# EAGLE design Switching and Pico (EAGLE 9.6.2)
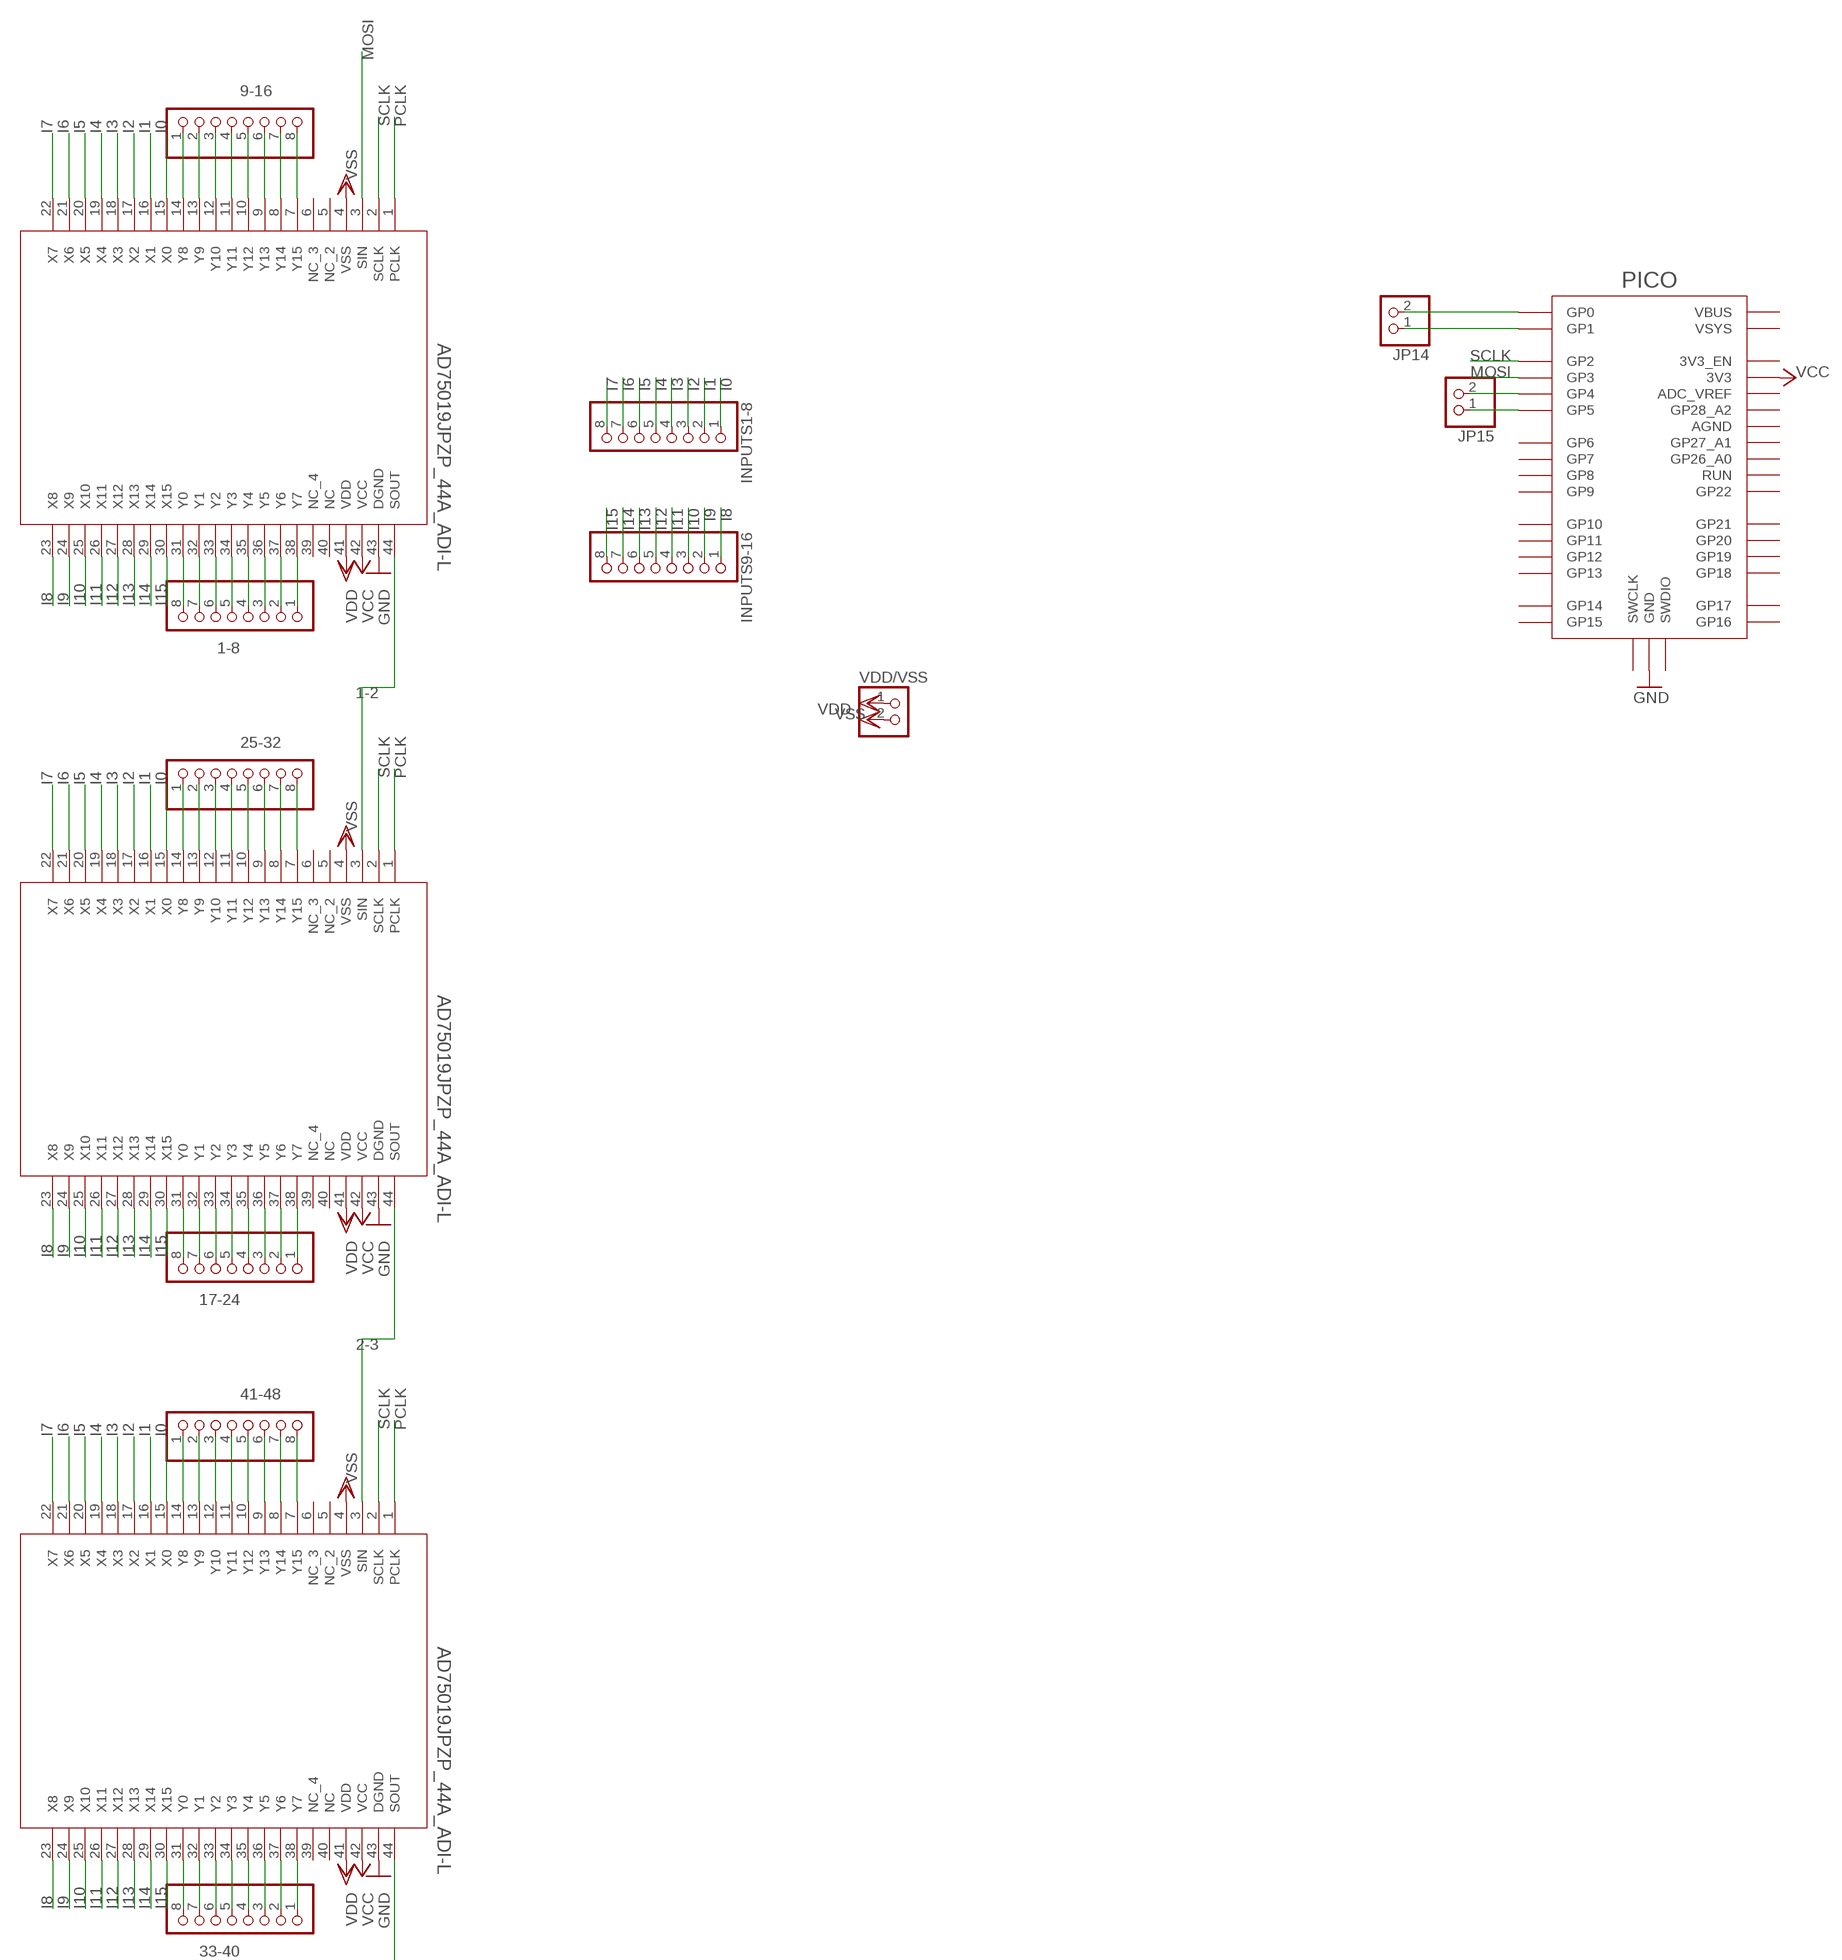
[diagram p0: schematic, sheet 1, part 1 of 2]
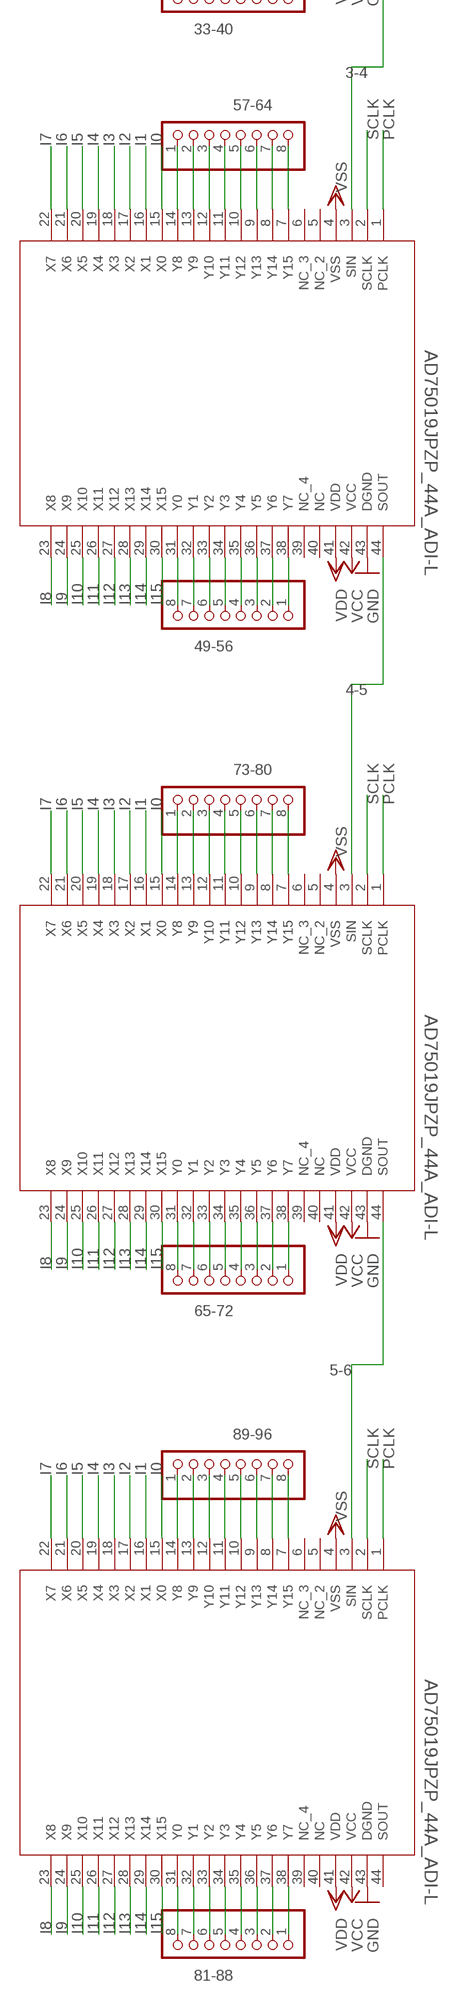
[diagram p1: schematic, sheet 1, part 2 of 2]

## Parts
1-8  PINHD-1X8  [1X08]
9-16  PINHD-1X8  [1X08]
17-24  PINHD-1X8  [1X08]
25-32  PINHD-1X8  [1X08]
33-40  PINHD-1X8  [1X08]
41-48  PINHD-1X8  [1X08]
49-56  PINHD-1X8  [1X08]
57-64  PINHD-1X8  [1X08]
65-72  PINHD-1X8  [1X08]
73-80  PINHD-1X8  [1X08]
81-88  PINHD-1X8  [1X08]
89-96  PINHD-1X8  [1X08]
INPUTS1-8  PINHD-1X8  [1X08]
INPUTS9-16  PINHD-1X8  [1X08]
JP14  PINHD-1X2  [1X02]
JP15  PINHD-1X2  [1X02]
PICO  RPI_PICO-TH  [RPI_PICO_TH]
SWITCH1  AD75019JPZP_44A_ADI-L  [P_44A_ADI-L]
SWITCH2  AD75019JPZP_44A_ADI-L  [P_44A_ADI-L]
SWITCH3  AD75019JPZP_44A_ADI-L  [P_44A_ADI-L]
SWITCH4  AD75019JPZP_44A_ADI-L  [P_44A_ADI-L]
SWITCH5  AD75019JPZP_44A_ADI-L  [P_44A_ADI-L]
SWITCH6  AD75019JPZP_44A_ADI-L  [P_44A_ADI-L]
VDD/VSS  PINHD-1X2  [1X02]

## Nets
1-2: SWITCH1.44(SOUT) SWITCH2.3(SIN)
2-3: SWITCH2.44(SOUT) SWITCH3.3(SIN)
3-4: SWITCH3.44(SOUT) SWITCH4.3(SIN)
4-5: SWITCH4.44(SOUT) SWITCH5.3(SIN)
5-6: SWITCH5.44(SOUT) SWITCH6.3(SIN)
GND: PICO.GND@1(GND) PICO.GND@2(GND) PICO.GND@3(GND) PICO.GND@4(GND) PICO.GND@5(GND) PICO.GND@6(GND) PICO.GND@7(GND) PICO.GND@8(GND) SWITCH1.43(DGND) SWITCH2.43(DGND) SWITCH3.43(DGND) SWITCH4.43(DGND) SWITCH5.43(DGND) SWITCH6.43(DGND)
I0: INPUTS1-8.1 SWITCH1.15(X0) SWITCH2.15(X0) SWITCH3.15(X0) SWITCH4.15(X0) SWITCH5.15(X0) SWITCH6.15(X0)
I1: INPUTS1-8.2 SWITCH1.16(X1) SWITCH2.16(X1) SWITCH3.16(X1) SWITCH4.16(X1) SWITCH5.16(X1) SWITCH6.16(X1)
I2: INPUTS1-8.3 SWITCH1.17(X2) SWITCH2.17(X2) SWITCH3.17(X2) SWITCH4.17(X2) SWITCH5.17(X2) SWITCH6.17(X2)
I3: INPUTS1-8.4 SWITCH1.18(X3) SWITCH2.18(X3) SWITCH3.18(X3) SWITCH4.18(X3) SWITCH5.18(X3) SWITCH6.18(X3)
I4: INPUTS1-8.5 SWITCH1.19(X4) SWITCH2.19(X4) SWITCH3.19(X4) SWITCH4.19(X4) SWITCH5.19(X4) SWITCH6.19(X4)
I5: INPUTS1-8.6 SWITCH1.20(X5) SWITCH2.20(X5) SWITCH3.20(X5) SWITCH4.20(X5) SWITCH5.20(X5) SWITCH6.20(X5)
I6: INPUTS1-8.7 SWITCH1.21(X6) SWITCH2.21(X6) SWITCH3.21(X6) SWITCH4.21(X6) SWITCH5.21(X6) SWITCH6.21(X6)
I7: INPUTS1-8.8 SWITCH1.22(X7) SWITCH2.22(X7) SWITCH3.22(X7) SWITCH4.22(X7) SWITCH5.22(X7) SWITCH6.22(X7)
I8: INPUTS9-16.1 SWITCH1.23(X8) SWITCH2.23(X8) SWITCH3.23(X8) SWITCH4.23(X8) SWITCH5.23(X8) SWITCH6.23(X8)
I9: INPUTS9-16.2 SWITCH1.24(X9) SWITCH2.24(X9) SWITCH3.24(X9) SWITCH4.24(X9) SWITCH5.24(X9) SWITCH6.24(X9)
I10: INPUTS9-16.3 SWITCH1.25(X10) SWITCH2.25(X10) SWITCH3.25(X10) SWITCH4.25(X10) SWITCH5.25(X10) SWITCH6.25(X10)
I11: INPUTS9-16.4 SWITCH1.26(X11) SWITCH2.26(X11) SWITCH3.26(X11) SWITCH4.26(X11) SWITCH5.26(X11) SWITCH6.26(X11)
I12: INPUTS9-16.5 SWITCH1.27(X12) SWITCH2.27(X12) SWITCH3.27(X12) SWITCH4.27(X12) SWITCH5.27(X12) SWITCH6.27(X12)
I13: INPUTS9-16.6 SWITCH1.28(X13) SWITCH2.28(X13) SWITCH3.28(X13) SWITCH4.28(X13) SWITCH5.28(X13) SWITCH6.28(X13)
I14: INPUTS9-16.7 SWITCH1.29(X14) SWITCH2.29(X14) SWITCH3.29(X14) SWITCH4.29(X14) SWITCH5.29(X14) SWITCH6.29(X14)
I15: INPUTS9-16.8 SWITCH1.30(X15) SWITCH2.30(X15) SWITCH3.30(X15) SWITCH4.30(X15) SWITCH5.30(X15) SWITCH6.30(X15)
MOSI: PICO.GP3 SWITCH1.3(SIN)
N$2: 17-24.8 SWITCH2.31(Y0)
N$3: 17-24.7 SWITCH2.32(Y1)
N$4: 17-24.6 SWITCH2.33(Y2)
N$6: 17-24.5 SWITCH2.34(Y3)
N$7: 17-24.4 SWITCH2.35(Y4)
N$8: 17-24.3 SWITCH2.36(Y5)
N$9: 17-24.2 SWITCH2.37(Y6)
N$10: 17-24.1 SWITCH2.38(Y7)
N$11: 25-32.1 SWITCH2.14(Y8)
N$12: 25-32.2 SWITCH2.13(Y9)
N$13: 25-32.3 SWITCH2.12(Y10)
N$14: 25-32.4 SWITCH2.11(Y11)
N$15: 25-32.5 SWITCH2.10(Y12)
N$16: 25-32.6 SWITCH2.9(Y13)
N$17: 25-32.7 SWITCH2.8(Y14)
N$18: 1-8.8 SWITCH1.31(Y0)
N$19: 1-8.7 SWITCH1.32(Y1)
N$20: 1-8.6 SWITCH1.33(Y2)
N$21: 1-8.5 SWITCH1.34(Y3)
N$22: 1-8.4 SWITCH1.35(Y4)
N$23: 1-8.3 SWITCH1.36(Y5)
N$24: 1-8.2 SWITCH1.37(Y6)
N$25: 1-8.1 SWITCH1.38(Y7)
N$26: 9-16.1 SWITCH1.14(Y8)
N$27: 9-16.2 SWITCH1.13(Y9)
N$28: 9-16.3 SWITCH1.12(Y10)
N$29: 9-16.4 SWITCH1.11(Y11)
N$30: 9-16.5 SWITCH1.10(Y12)
N$31: 9-16.6 SWITCH1.9(Y13)
N$32: 9-16.7 SWITCH1.8(Y14)
N$33: 9-16.8 SWITCH1.7(Y15)
N$34: 25-32.8 SWITCH2.7(Y15)
N$36: 33-40.8 SWITCH3.31(Y0)
N$37: 33-40.7 SWITCH3.32(Y1)
N$38: 33-40.6 SWITCH3.33(Y2)
N$39: 33-40.5 SWITCH3.34(Y3)
N$40: 33-40.4 SWITCH3.35(Y4)
N$41: 33-40.3 SWITCH3.36(Y5)
N$42: 33-40.2 SWITCH3.37(Y6)
N$43: 33-40.1 SWITCH3.38(Y7)
N$44: 41-48.1 SWITCH3.14(Y8)
N$45: 41-48.2 SWITCH3.13(Y9)
N$46: 41-48.3 SWITCH3.12(Y10)
N$47: 41-48.4 SWITCH3.11(Y11)
N$48: 41-48.5 SWITCH3.10(Y12)
N$49: 41-48.6 SWITCH3.9(Y13)
N$50: 41-48.7 SWITCH3.8(Y14)
N$51: 41-48.8 SWITCH3.7(Y15)
N$53: 49-56.8 SWITCH4.31(Y0)
N$54: 49-56.7 SWITCH4.32(Y1)
N$55: 49-56.6 SWITCH4.33(Y2)
N$56: 49-56.5 SWITCH4.34(Y3)
N$57: 49-56.4 SWITCH4.35(Y4)
N$58: 49-56.3 SWITCH4.36(Y5)
N$59: 49-56.2 SWITCH4.37(Y6)
N$60: 49-56.1 SWITCH4.38(Y7)
N$61: 57-64.1 SWITCH4.14(Y8)
N$62: 57-64.2 SWITCH4.13(Y9)
N$63: 57-64.3 SWITCH4.12(Y10)
N$64: 57-64.4 SWITCH4.11(Y11)
N$65: 57-64.5 SWITCH4.10(Y12)
N$66: 57-64.6 SWITCH4.9(Y13)
N$67: 57-64.7 SWITCH4.8(Y14)
N$68: 57-64.8 SWITCH4.7(Y15)
N$70: 65-72.8 SWITCH5.31(Y0)
N$71: 65-72.7 SWITCH5.32(Y1)
N$72: 65-72.6 SWITCH5.33(Y2)
N$73: 65-72.5 SWITCH5.34(Y3)
N$74: 65-72.4 SWITCH5.35(Y4)
N$75: 65-72.3 SWITCH5.36(Y5)
N$76: 65-72.2 SWITCH5.37(Y6)
N$77: 65-72.1 SWITCH5.38(Y7)
N$78: 73-80.1 SWITCH5.14(Y8)
N$79: 73-80.2 SWITCH5.13(Y9)
N$80: 73-80.3 SWITCH5.12(Y10)
N$81: 73-80.4 SWITCH5.11(Y11)
N$82: 73-80.5 SWITCH5.10(Y12)
N$83: 73-80.6 SWITCH5.9(Y13)
N$84: 73-80.7 SWITCH5.8(Y14)
N$85: 73-80.8 SWITCH5.7(Y15)
N$86: JP14.2 PICO.GP0
N$87: 81-88.8 SWITCH6.31(Y0)
N$88: 81-88.7 SWITCH6.32(Y1)
N$89: 81-88.6 SWITCH6.33(Y2)
N$90: 81-88.5 SWITCH6.34(Y3)
N$91: 81-88.4 SWITCH6.35(Y4)
N$92: 81-88.3 SWITCH6.36(Y5)
N$93: 81-88.2 SWITCH6.37(Y6)
N$94: 81-88.1 SWITCH6.38(Y7)
N$95: 89-96.1 SWITCH6.14(Y8)
N$96: 89-96.2 SWITCH6.13(Y9)
N$97: 89-96.3 SWITCH6.12(Y10)
N$98: 89-96.4 SWITCH6.11(Y11)
N$99: 89-96.5 SWITCH6.10(Y12)
N$100: 89-96.6 SWITCH6.9(Y13)
N$101: 89-96.7 SWITCH6.8(Y14)
N$102: 89-96.8 SWITCH6.7(Y15)
N$103: JP14.1 PICO.GP1
N$104: JP15.2 PICO.GP4
N$105: JP15.1 PICO.GP5
PCLK: SWITCH1.1(PCLK) SWITCH2.1(PCLK) SWITCH3.1(PCLK) SWITCH4.1(PCLK) SWITCH5.1(PCLK) SWITCH6.1(PCLK)
SCLK: PICO.GP2 SWITCH1.2(SCLK) SWITCH2.2(SCLK) SWITCH3.2(SCLK) SWITCH4.2(SCLK) SWITCH5.2(SCLK) SWITCH6.2(SCLK)
VCC: PICO.3V3 SWITCH1.42(VCC) SWITCH2.42(VCC) SWITCH3.42(VCC) SWITCH4.42(VCC) SWITCH5.42(VCC) SWITCH6.42(VCC)
VDD: SWITCH1.41(VDD) SWITCH2.41(VDD) SWITCH3.41(VDD) SWITCH4.41(VDD) SWITCH5.41(VDD) SWITCH6.41(VDD) VDD/VSS.1
VSS: SWITCH1.4(VSS) SWITCH2.4(VSS) SWITCH3.4(VSS) SWITCH4.4(VSS) SWITCH5.4(VSS) SWITCH6.4(VSS) VDD/VSS.2
Unconnected: PICO.3V3_EN PICO.ADC_VREF PICO.AGND PICO.GP6 PICO.GP7 PICO.GP8 PICO.GP9 PICO.GP10 PICO.GP11 PICO.GP12 PICO.GP13 PICO.GP14 PICO.GP15 PICO.GP16 PICO.GP17 PICO.GP18 PICO.GP19 PICO.GP20 PICO.GP21 PICO.GP22 PICO.GP26_A0 PICO.GP27_A1 PICO.GP28_A2 PICO.RUN PICO.SWCLK PICO.SWDIO PICO.VBUS PICO.VSYS SWITCH1.5(NC_2) SWITCH1.6(NC_3) SWITCH1.39(NC_4) SWITCH1.40(NC) SWITCH2.5(NC_2) SWITCH2.6(NC_3) SWITCH2.39(NC_4) SWITCH2.40(NC) SWITCH3.5(NC_2) SWITCH3.6(NC_3) SWITCH3.39(NC_4) SWITCH3.40(NC) SWITCH4.5(NC_2) SWITCH4.6(NC_3) SWITCH4.39(NC_4) SWITCH4.40(NC) SWITCH5.5(NC_2) SWITCH5.6(NC_3) SWITCH5.39(NC_4) SWITCH5.40(NC) SWITCH6.5(NC_2) SWITCH6.6(NC_3) SWITCH6.39(NC_4) SWITCH6.40(NC) SWITCH6.44(SOUT)

## Library data of the parts
1-8 9-16 17-24 25-32 33-40 41-48 49-56 57-64 65-72 73-80 81-88 89-96 INPUTS1-8 INPUTS9-16 = pinhead:PINHD-1X8: PIN HEADER
JP14 JP15 VDD/VSS = pinhead:PINHD-1X2: PIN HEADER
PICO = RaspberryPi_Pico:RPI_PICO
SWITCH1-SWITCH6 = AD75019JPZ:AD75019JPZ; COPYRIGHT: Copyright (C) 2024 Ultra Librarian. All rights reserved.; MANUFACTURER_PART_NUMBER: AD75019JPZ; MFR_NAME: Analog Devices Inc

## Board
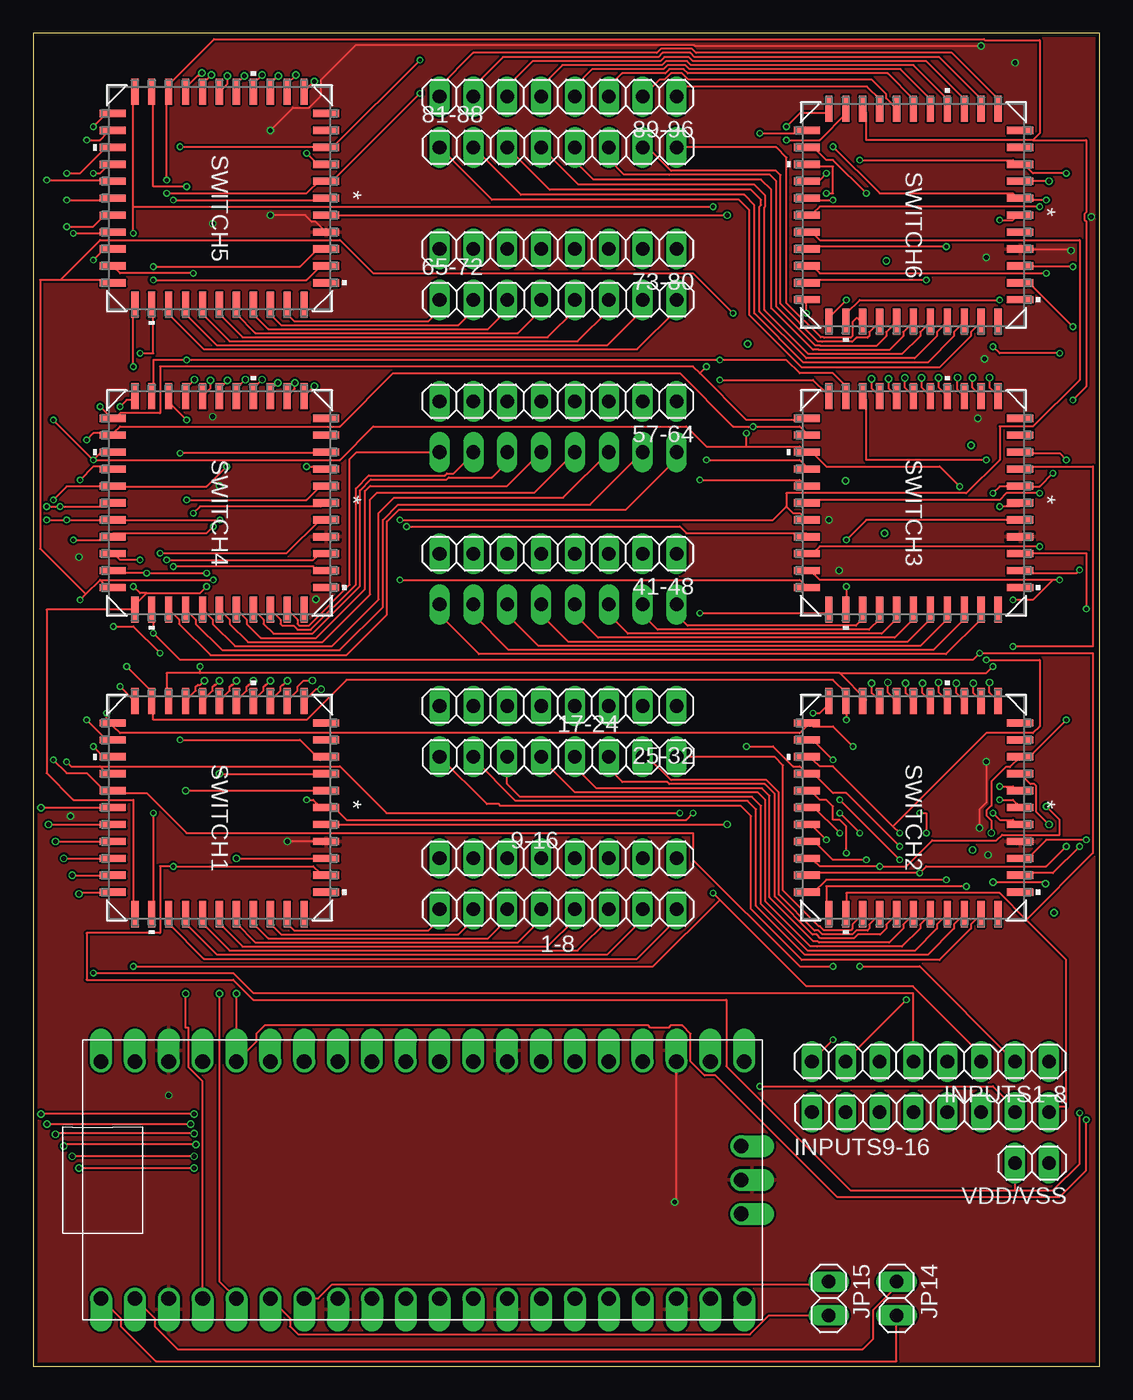
[diagram p2: board, top side]
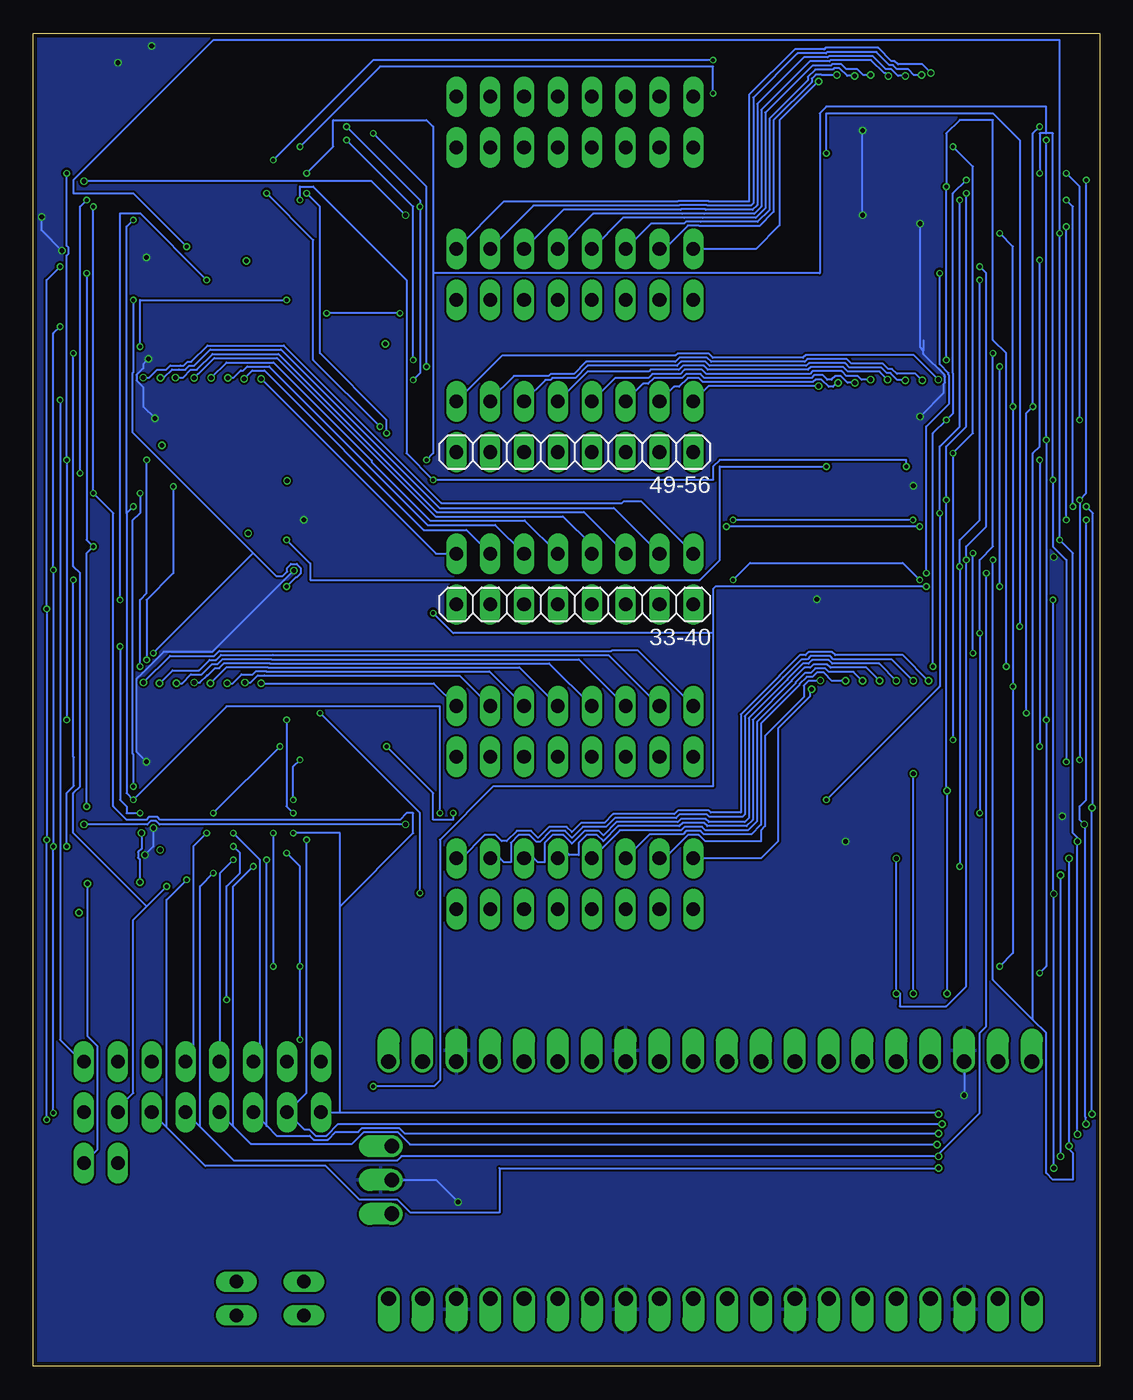
[diagram p3: board, bottom side, seen from below]

Size 80 x 100 mm. Coordinates in mm from the lower left corner, seen from the top.
Outline: 0,0 80,0 80,100 0,100 0,0
Copper layers (1*16): Top 0.035mm / dielectric 1.5mm / Bottom 0.035mm
Design rules "PCBWay_2L_152um-Track": minimum track width 6mil, minimum drill 0.3mm, track to track 6mil, track to pad 6mil, pad to pad 6mil, via to via 6mil, smd to smd 0mil, copper to edge 0.3mm, drill to drill 10mil, minimum pad ring 6mil, minimum via ring 0.1mm, stop-mask expansion 2mil, vias tented up to drill 0.45mm, thermal gap 0.2mm

### Footprints (pad centres in the part's own frame; a part is rotated, then mirrored left to right if it is on the bottom)
1X08 = drill 1.016 long: 1 -8.89,0; 2 -6.35,0; 3 -3.81,0; 4 -1.27,0; 5 1.27,0; 6 3.81,0; 7 6.35,0; 8 8.89,0
1X02 = drill 1.016 long: 1 -1.27,0; 2 1.27,0
RPI_PICO_TH = drill 1.1 pad 1.6 offset: 3V3 8.89,13.97; 3V3_EN 8.89,16.51; ADC_VREF 8.89,11.43; AGND 8.89,6.35; GND@1 -8.89,19.05; GND@2 -8.89,6.35; GND@3 -8.89,-6.35; GND@4 -8.89,-19.05; GND@5 0,-23.9; GND@6 8.89,-19.05; GND@7 8.89,-6.35; GND@8 8.89,19.05; GP0 -8.89,24.13; GP1 -8.89,21.59; GP2 -8.89,16.51; GP3 -8.89,13.97; GP4 -8.89,11.43; GP5 -8.89,8.89; GP6 -8.89,3.81; GP7 -8.89,1.27; GP8 -8.89,-1.27; GP9 -8.89,-3.81; GP10 -8.89,-8.89; GP11 -8.89,-11.43; GP12 -8.89,-13.97; GP13 -8.89,-16.51; GP14 -8.89,-21.59; GP15 -8.89,-24.13; GP16 8.89,-24.13; GP17 8.89,-21.59; GP18 8.89,-16.51; GP19 8.89,-13.97; GP20 8.89,-11.43; GP21 8.89,-8.89; GP22 8.89,-3.81; GP26_A0 8.89,1.27; GP27_A1 8.89,3.81; GP28_A2 8.89,8.89; RUN 8.89,-1.27; SWCLK -2.54,-23.9; SWDIO 2.54,-23.9; VBUS 8.89,24.13; VSYS 8.89,21.59
P_44A_ADI-L = smd 0.543 x 1.955: 1 0,7.999; 2 -1.27,7.999; 3 -2.54,7.999; 4 -3.81,7.999; 5 -5.08,7.999; 6 -6.35,7.999; 18 -6.35,-7.999; 19 -5.08,-7.999; 20 -3.81,-7.999; 21 -2.54,-7.999; 22 -1.27,-7.999; 23 0,-7.999; 24 1.27,-7.999; 25 2.54,-7.999; 26 3.81,-7.999; 27 5.08,-7.999; 28 6.35,-7.999; 40 6.35,7.999; 41 5.08,7.999; 42 3.81,7.999; 43 2.54,7.999; 44 1.27,7.999 | smd 1.955 x 0.543: 7 -7.999,6.35; 8 -7.999,5.08; 9 -7.999,3.81; 10 -7.999,2.54; 11 -7.999,1.27; 12 -7.999,0; 13 -7.999,-1.27; 14 -7.999,-2.54; 15 -7.999,-3.81; 16 -7.999,-5.08; 17 -7.999,-6.35; 29 7.999,-6.35; 30 7.999,-5.08; 31 7.999,-3.81; 32 7.999,-2.54; 33 7.999,-1.27; 34 7.999,0; 35 7.999,1.27; 36 7.999,2.54; 37 7.999,3.81; 38 7.999,5.08; 39 7.999,6.35

### Placement (x,y rotation side)
1-8  39.37,34.29 0 top
9-16  39.37,38.1 180 top
17-24  39.37,45.72 0 top
25-32  39.37,49.53 180 top
33-40  39.37,57.15 180 bottom
41-48  39.37,60.96 180 top
49-56  39.37,68.58 180 bottom
57-64  39.37,72.39 180 top
65-72  39.37,80.01 0 top
73-80  39.37,83.82 180 top
81-88  39.37,91.44 0 top
89-96  39.37,95.25 180 top
INPUTS1-8  67.31,22.86 180 top
INPUTS9-16  67.31,19.05 0 top
JP14  64.77,5.08 270 top
JP15  59.69,5.08 270 top
PICO  29.21,13.97 90 top
SWITCH1  13.97,41.91 270 top
SWITCH2  66.04,41.91 270 top
SWITCH3  66.04,64.77 270 top
SWITCH4  13.97,64.77 270 top
SWITCH5  13.97,87.63 270 top
SWITCH6  66.04,86.36 270 top
VDD/VSS  74.93,15.24 0 top

### Tracks (layer width: path | path; a pad name or v marks a point on that pad's centre or on a via)
1-2  (via drill 0.35)
  Top 0.152: SWITCH1.44 v52.07,40.64 | v76.2,40.64 75.25,41.59 75.25,43.55 75.11,43.68 74.81,43.68 SWITCH2.3
  Bottom 0.152: v52.07,40.64 70.53,40.64 70.78,40.89 71.2,40.89 71.45,40.64 v76.2,40.64
2-3  (via drill 0.3)
  Top 0.152: v72,41.5 72.5,41 73.5,41 74,40.5 SWITCH2.44 | v73.5,54 79.5,54 79.5,67.5 74.5,67.5 SWITCH3.3
  Bottom 0.152: v72,41.5 73,41.5 73,42 73.5,42.5 v73.5,54
3-4  (via drill 0.3)
  Top 0.152: v20.5,67.5 21.5,67.5 SWITCH4.3 | v61,62 62.5,63.5 SWITCH3.44
  Bottom 0.152: v20.5,67.5 28.5,67.5 28.5,60.5 30,59 59.22,59 59.22,60.22 v61,62
4-5  (via drill 0.3)
  Top 0.152: v9.5,61 19,61 21.5,63.5 SWITCH4.44 | v9.5,53.5 7.5,55.5 v6,55.5 | v20.5,91 21.5,90 SWITCH5.3
  Bottom 0.152: v9.5,53.5 v9.5,61 | v6,55.5 6,92 8,94 20.5,94 v20.5,91
5-6  (via drill 0.35)
  Top 0.152: SWITCH5.44 v52.07,86.36 | v76.2,88.9 SWITCH6.3
  Bottom 0.152: v52.07,86.36 54.61,88.9 v76.2,88.9
GND  (via drill 0.35)
  Top 0.152: SWITCH1.43 v19.05,39.37 | SWITCH5.43 21.2,85.86 20.9,85.86 20.4,86.36 v17.78,86.36 | v17.78,92.71 19.49,94.42 20.69,94.42 21.59,95.32 21.59,96.52 24.21,99.14 49.55,99.14 49.63,99.06 v71.12,99.06 | SWITCH6.43 77.72,83.82 v77.85,83.69 | v48.13,12.32 48.26,12.45 PICO.GND@6 | v71.5,45.34 71.5,42.29 70.99,41.78 v70.99,40.39
  Bottom 0.152: PICO.GND@8 v10.16,20.32 | v17.78,86.36 v17.78,92.71 | v77.85,83.69 79.38,85.22 v79.38,86.23 | v48.13,12.32 49.78,13.97 PICO.GND@5 | v71.37,75.56 71.75,75.18 71.75,74.88 72.26,74.38 72.26,73.96 71.75,73.46 71.75,72.01 v70.87,71.12 | v60.45,59.69 61.16,58.98 61.2,58.98 66.58,53.59 70.23,53.59 71.8,52.02 72.26,51.56 72.26,46.1 v71.5,45.34 | v70.99,40.39 70.99,38.99 v71.63,38.35 | v13.46,71.25 11.68,73.03 11.68,73.71 11.59,73.81 11.59,74.22 11.64,74.28 11.64,74.38 13.21,75.95 13.21,76.2 | 13.21,76.96 13.21,76.2 | 13.21,76.2 13.46,76.45 v13.46,85.72
  other vias: 73.66,97.79 3.43,60.71 2.79,41.27 71.5,83.19 13.97,66.04 59.69,63.5 21.21,57.53
  pour Top: -1.27,100.33 82.55,100.33 82.55,-2.54 -1.27,-2.54
  pour Bottom: -1.27,102.87 78.74,102.87 81.28,100.33 81.28,-2.54 80.01,-1.27 -3.81,-1.27 -3.81,102.87
GND1  (via drill 0.35)
  other vias: 63.88,62.48
GND2  (via drill 0.35)
  other vias: 70.36,69.09
GND3  (via drill 0.35)
  other vias: 70.48,38.73
GND4  (via drill 0.35)
  other vias: 76.58,34.04
GND5  (via drill 0.35)
  other vias: 60.96,66.42
GND6  (via drill 0.35)
  other vias: 53.59,76.71
GND7  (via drill 0.35)
  other vias: 64.01,82.93
I0  (via drill 0.3)
  Top 0.152: 60.5,52 12.5,52 | 12.5,52 10,52 10,50 SWITCH1.15 | 60.5,52 62.5,50 SWITCH2.15 | v11.5,71 10,72.5 SWITCH4.15 | 12.5,52 v12.5,52.5 | v10,89 10,95.5 SWITCH5.15 10,96 13.56,99.56 71.33,99.56 71.39,99.5 75.5,99.5 75.5,92.5 75,92 | v71.5,68 62.5,68 62.5,72.5 SWITCH3.15 | v72,52.5 71.5,52 60.5,52 | 75,92 62.5,92 62.5,94 SWITCH6.15 | v78,72.5 79,73.5 79,85.9 78.87,86.02 78.87,86.44 79,86.57 79,92 75,92
  Bottom 0.152: v12.5,52.5 12.5,70 v11.5,71 10.98,71.52 10.98,74.47 11,74.5 11,88 v10,89 | v71.5,68 71.5,58 72,57.5 v72,52.5 | v78,72.5 78,24.5 76.5,23 INPUTS1-8.1
I1  (via drill 0.3)
  Top 0.152: SWITCH4.16 9,73 9,75.5 v11.5,75.5 v51.5,75.5 56.5,75.5 57.5,74.5 60,74.5 61,73.5 61,73 SWITCH3.16 | v11.5,88.5 9,88.5 9,95.5 SWITCH5.16 | v56.5,92 59,92 61,94 SWITCH6.16 | v62,30 66.5,30 73.5,23 INPUTS1-8.2 | v60.5,41.5 v62,40 | v61,48.5 61,49.5 SWITCH2.16 61,50 61,50.5 60,51.5 23.5,51.5 20.5,48.5 9,48.5 9,49.5 SWITCH1.16 9,50 9,50.5 v7,52.5
  Bottom 0.152: v11.5,75.5 v11.5,88.5 11.5,92.5 10.5,93.5 8,93.5 8,77 7,76 v7,52.5 | v56.5,92 51.5,87 v51.5,75.5 | v62,40 v62,30 | v60.5,41.5 61,42 v61,48.5
I2  (via drill 0.3)
  Top 0.152: v58.5,49 59,49 59.5,49.5 SWITCH2.17 | 51.5,35 58,28.5 66,28.5 71.5,23 INPUTS1-8.3 | 51.5,35 v51,35.5 | v51.5,74 58.5,74 59.5,73 SWITCH3.17 | v56.5,93 57.5,94 59.5,94 SWITCH6.17 | v6.5,51 7.5,50 SWITCH1.17 | v6.5,72 7,72.5 7.5,72.5 SWITCH4.17 | v7.5,85 7.5,87 | 7.5,87 7.5,95.5 SWITCH5.17 | 7.5,87 v51,87 | 51.5,35 46.5,30 v7.5,30
  Bottom 0.152: v58.5,49 51,41.5 v51,35.5 | v51.5,74 51,74.5 v51,87 51,87.5 v56.5,93 | v7.5,85 6.5,84 v6.5,72 v6.5,51 6.5,31 v7.5,30
I3  (via drill 0.3)
  Top 0.152: 6,71 6.5,71.5 9.5,71.5 9.5,75 49.5,75 50,74.5 | 50,74.5 53.5,71 58,71 SWITCH3.18 | v4.5,93 5.5,94 SWITCH5.18 | 6,71 v5,72 | 6,71 SWITCH4.18 | v54.5,92.5 58,92.5 SWITCH6.18 | 50,74.5 v50.5,75 | v67,40 67,41.5 v66.5,41.5 | v61.5,46.5 60,48 58.5,48 SWITCH2.18 58,48 57.5,47.5 6.5,47.5 6,48 SWITCH1.18 5.5,48.5 v5.5,49
  Bottom 0.152: v4.5,93 5,92.5 v5,72 5.5,71.5 v5.5,49 | v54.5,92.5 50.5,88.5 v50.5,75 | v67,40 68,39 68,23.5 68.5,23 INPUTS1-8.4 | v61.5,46.5 v66.5,41.5
I4  (via drill 0.3)
  Top 0.152: v60,45.5 58.5,47 SWITCH2.19 | v65,38 v60.5,42.5 | v4,48.5 5.5,47 SWITCH1.19 | v4,69.5 4.5,70 5.5,70 SWITCH4.19 6,70 6.5,70.5 23,70.5 27,74.5 48.5,74.5 52.5,70.5 v54,70.5 57.5,70.5 58,70 SWITCH3.19 | v4,92 5,92 5.5,92.5 SWITCH5.19 | v62.5,88 60,90.5 59.5,90.5 58.5,91.5 SWITCH6.19 | v4.5,29.5 15,29.5 16.5,28 66,28 66,23 INPUTS1-8.5
  Bottom 0.152: v60,45.5 60.5,45 v60.5,42.5 | v65,38 66,37 66,23 INPUTS1-8.5 | v4,92 v4,69.5 v4,48.5 4,30 v4.5,29.5 | v62.5,88 59,84.5 59,75.5 v54,70.5
I5  (via drill 0.3)
  Top 0.152: v65,40 64.5,40.5 | 64.5,40.5 60,45 59,45 58.5,45.5 SWITCH2.20 | v4.5,46.5 5.5,45.5 SWITCH1.20 | v4.5,68 5,68.5 5.5,68.5 SWITCH4.20 | v2.5,89.5 3.5,89.5 5.5,91.5 SWITCH5.20 | v4.5,68 v1.5,71 | 53.5,69 50.5,69 49,70.5 25.5,70.5 23,68 v4.5,68 | 53.5,69 57.5,69 58,68.5 SWITCH3.20 58.5,68.5 59.5,67.5 68,67.5 v69.5,66 | v59.5,88 60,88 60,90 58.5,90 SWITCH6.20 | 53.5,69 v53.5,70 | 64.5,40.5 71.5,47.5 75,47.5 75.5,48 75.5,53 v71.5,53
  Bottom 0.152: v65,40 63,38 63,23.5 63.5,23 INPUTS1-8.6 | v4.5,68 v4.5,46.5 | v2.5,89.5 1.5,88.5 v1.5,71 | v59.5,88 58.5,87 58.5,76 53.5,71 v53.5,70 | v71.5,53 71.5,57.5 69.5,59.5 v69.5,66
I6  (via drill 0.3)
  Top 0.152: v50.5,68 57.5,68 58,67.5 SWITCH3.21 | v59.5,89.5 59,89 58.5,89 SWITCH6.21 | v65,39 61,43 60,43 58.5,44.5 SWITCH2.21 58,44.5 57.5,45 57,45 55.5,46.5 v53.5,46.5 | v65.5,27.5 61,23 INPUTS1-8.7 | v2.49,45.35 2.84,45 5,45 | 5,45 5.5,44.5 SWITCH1.21 | v3.5,66.5 4.5,67.5 5.5,67.5 SWITCH4.21 | v4.5,89.5 5,89.5 5.5,90 SWITCH5.21 | v48.5,41.5 26.5,41.5 23,45 5,45
  Bottom 0.152: v50.5,68 50,68.5 50,82 | 50,82 50,93 50.5,93.5 57.5,93.5 57.5,91.5 v59.5,89.5 | v65,39 64.5,38.5 64.5,37 65.5,36 v65.5,27.5 | v2.49,45.35 2.49,60.49 3.5,61.5 v3.5,66.5 3.5,92.5 4,92.5 | v4.5,89.5 4.5,92.5 4,92.5 | v53.5,46.5 50,43 50,41 48.5,41 v48.5,41.5 | 50,82 21,82 21,94 20.5,94.5 4,94.5 4,92.5
I7  (via drill 0.3)
  Top 0.152: v50,66.5 57.5,66.5 58,66 SWITCH3.22 | v60,87.5 58.5,87.5 SWITCH6.22 | v61,38.5 61,40.5 60.5,41 60,41 60,42 59.5,42.5 59,42.5 58.5,43 SWITCH2.22 | v60,24.5 58.5,23 INPUTS1-8.8 | v1.5,45.5 2.5,44.5 4,44.5 5.5,43 SWITCH1.22 6,43 8.5,43 11.5,40 49.5,40 49.5,38 57.5,30 v60,30 | v1.5,65 2.5,66 5.5,66 SWITCH4.22 6,66 13,66 v14.5,67.5 | v1,89 5.5,89 SWITCH5.22
  Bottom 0.152: v60,87.5 60,88.5 59,88.5 52,81.5 52,68.5 v50,66.5 29,66.5 29,67.5 28.5,68 14.5,68 v14.5,67.5 | v61,38.5 60,37.5 v60,30 v60,24.5 | v1.5,45.5 v1.5,65 1,65.5 v1,89
I8  (via drill 0.3, 0.35)
  Top 0.152: v12.06,18.92 v0.57,18.92 | v0.57,41.91 SWITCH1.23 | v1,64.5 v2,64.5 5.5,64.5 SWITCH4.23 | v60.5,40 58.5,42 SWITCH2.23 | v75.5,65.5 73,65.5 72.5,65 58.5,65 SWITCH3.23 | v75.5,87 59,87 58.5,86.5 SWITCH6.23 | v2.5,87.5 5.5,87.5 SWITCH5.23
  Bottom 0.152: INPUTS9-16.1 57,19.05 | v12.06,18.92 12.19,19.05 57,19.05 | v0.57,18.92 v0.57,41.91 0.5,42 0.5,64 v1,64.5 | v60.5,40 57,40 57,34.5 | 57,19.05 57,34.5 | 57,34.5 51.5,40 51.5,41.5 52,41.5 52.5,41 70.46,41 70.66,41.19 71.33,41.19 71.52,41 73,41 74,42 74,64 v75.5,65.5 v75.5,87 | v2.5,87.5 2,87 v2,64.5
I9  (via drill 0.3, 0.35)
  Top 0.152: v11.81,18.16 v1.02,18.16 | v1.14,40.64 SWITCH1.24 | 56.5,64.5 57,64 57.5,64 58,63.5 SWITCH3.24 | 56.5,64.5 56.5,65.5 70,65.5 72.5,68 72.5,70.5 75,70.5 78.5,74 78.5,84.5 59,84.5 58.5,85 SWITCH6.24 | v1,63.5 v2.5,63.5 SWITCH4.24 v14,63.5 | v2.5,85.5 4.5,85.5 5.5,86.5 SWITCH5.24 | v59.5,39.5 58.5,40.5 SWITCH2.24 | 56.5,64.5 55.5,63.5 v27.5,63.5
  Bottom 0.152: v1.02,18.16 1.02,18.65 1.08,18.71 1.08,40.58 v1.14,40.64 1,40.5 1.5,41 1.5,42 1,42.5 v1,63.5 | v2.5,63.5 v2.5,85.5 | v59.5,39.5 59.5,20.5 60.5,19.5 INPUTS9-16.2 59.67,17.76 59.3,17.76 58.83,17.3 58.01,17.3 57.13,18.17 52.42,18.17 52.41,18.16 v11.81,18.16 | v14,63.5 v27.5,63.5
I10  (via drill 0.3, 0.35)
  Top 0.152: v12.06,17.46 1.71,17.46 v1.65,17.4 | v1.65,39.37 SWITCH1.25 | v3,62 5.5,62 SWITCH4.25 6,62.5 13,62.5 v13.5,63 | v62.5,38 60,38 58.5,39.5 SWITCH2.25 | v28,63 48.5,63 49,62.5 58,62.5 SWITCH3.25 | v68.5,84 58.5,84 SWITCH6.25 | v3,85 5.5,85 SWITCH5.25
  Bottom 0.152: INPUTS9-16.3 62.48,18.02 | 62.48,18.02 61.75,17.3 59.26,17.3 58.96,16.99 57.88,16.99 57.31,17.56 55.63,17.56 55.32,17.87 52.55,17.87 52.14,17.46 v12.06,17.46 | v1.65,17.4 v1.65,39.37 1.5,39.5 2,40 2,61 v3,62 v3,85 3,99.5 66.5,99.5 77,89 77,88 72.5,88 v68.5,84 | v62.5,38 62.5,18 62.48,18.02 | v13.5,63 v28,63
I11  (via drill 0.3, 0.35)
  Top 0.152: v12.19,16.64 2.41,16.64 v2.29,16.51 | v2.29,38.1 SWITCH1.26 | v75.5,61.5 59,61.5 58.5,61 SWITCH3.26 | v76,82 59,82 58.5,82.5 SWITCH6.26 | v8,60.5 6.5,60.5 6,61 SWITCH4.26 | v4.5,83 5.5,84 SWITCH5.26 | SWITCH2.26 58.5,38 59,37.5 v63.5,37.5 65.5,37.5 67.45,39.45 72.26,39.45 72.69,39.87 77,39.87 77,41 v76,42
  Bottom 0.152: INPUTS9-16.4 65,18 | 65,18 63.68,16.69 56.07,16.69 55.2,17.56 52.67,17.56 51.75,16.64 v12.19,16.64 | v2.29,38.1 v2.29,16.51 2.5,16.5 2,16 2,14 3.5,14 4,14.5 4,25 5,26 | v76,82 76,62 v75.5,61.5 76,61 v76,42 | v8,60.5 8,29 5,26 | v4.5,83 4.5,69 5,68.5 5,26 | v63.5,37.5 65,36 65,18
I12  (via drill 0.3, 0.35)
  Top 0.152: v12.06,15.75 v2.92,15.75 | v2.92,36.83 SWITCH1.27 | SWITCH4.27 6,59.5 v8.5,59.5 v13,59.5 | v12,82 6.5,82 6,82.5 SWITCH5.27 | SWITCH2.27 58.5,37 v66.5,37 67,37.5 76,37.5 v77.5,39 | v77,59 76.5,59 | 76.5,59 59,59 58.5,59.5 SWITCH3.27 | v67,81.5 58.5,81.5 SWITCH6.27 | v73.5,57.5 75,57.5 76.5,59
  Bottom 0.152: INPUTS9-16.5 67.52,17.98 | 67.52,17.98 64.99,15.46 52.67,15.46 52.38,15.75 v12.06,15.75 12,16 9,19 9,25 8.5,25.5 v8.5,59.5 | v2.92,15.75 v2.92,36.83 | v13,59.5 13,70.5 11.28,72.22 11.28,74.35 11.34,74.41 11.34,74.51 12,75.17 v12,82 | v66.5,37 67.5,36 67.5,18 67.52,17.98 | v77.5,39 77.5,43 76.97,43.53 76.97,45.67 77,45.71 v77,59 | v67,81.5 72,86.5 73.5,86.5 v73.5,57.5
I13  (via drill 0.3, 0.35)
  Top 0.152: v12.06,14.86 v3.43,14.86 | v3.43,35.43 3.56,35.56 SWITCH1.28 | v68.5,36.5 59.5,36.5 58.5,35.5 SWITCH2.28 | 3.92,57.92 0.5,61.34 0.5,81.5 2,81.5 | 5,59 5.5,58.5 SWITCH4.28 | 2,81.5 5.5,81.5 SWITCH5.28 | v27.5,59 57.5,59 58,58.5 SWITCH3.28 | 5,59 v13.5,59 | v58,79 58,80 SWITCH6.28 | v52.5,79 49.5,82 25.5,82 23,84.5 5,84.5 2,81.5 | 5,59 3.92,57.92 | 3.92,57.92 v3.5,57.5
  Bottom 0.152: INPUTS9-16.6 70.03,17.96 | 70.03,17.96 67.09,15.02 58.07,15.02 55.53,12.48 52.67,12.48 51.71,11.52 45.03,11.52 45.03,14.86 v12.06,14.86 | v3.43,14.86 v3.43,35.43 3.5,35.5 v3.5,57.5 | v68.5,36.5 70,35 70,18 70.03,17.96 | v13.5,59 14.77,60.27 26.23,60.27 v27.5,59 | v52.5,79 v58,79
I14  (via drill 0.3)
  Top 0.152: v70,36 59.5,36 59.5,34 SWITCH2.29 | v61,80 59.5,78.5 SWITCH6.29 | v72,76.5 72.5,76 v77,76 | SWITCH1.29 7.5,34 7.5,42.5 3,42.5 1,44.5 1,56.75 7.61,56.75 SWITCH4.29 7.5,57 8.5,58 | v50,56.5 59.5,56.5 SWITCH3.29 | v13,58.5 12.5,58 8.5,58 | v7.5,75 7.5,79.5 SWITCH5.29 | v7.5,58.5 8,58 8.5,58 | v54.5,21 72,21 73.5,19.5 INPUTS9-16.7
  Bottom 0.152: 71.5,34.5 72.5,33.5 72.5,20.5 73.5,19.5 INPUTS9-16.7 | 71.5,34.5 v70,36 | v61,80 72,80 v72,76.5 | v77,76 77,60 76.5,59.5 76.5,43.5 77,43 77,40 71.5,34.5 | v50,56.5 48.5,55 29,55 | v13,58.5 28.8,58.5 29,58.3 29,55 | v7.5,58.5 v7.5,75 | 29,55 29,43.5 45.5,43.5 49.5,39.5 49.5,21.44 49.94,21 v54.5,21
I15  (via drill 0.3)
  Top 0.152: v9,41.5 9,34 SWITCH1.30 | SWITCH4.30 9,56.5 v9,55 11,53 70.5,53 v71,53.5 79.5,53.5 79.5,38.5 74.5,33.5 | v8,76 9,76 9,79.5 SWITCH5.30 | 74.5,33.5 77.5,30.5 77.5,19.5 76.5,19.5 INPUTS9-16.8 | 74.5,33.5 72.5,35.5 61,35.5 61,34 SWITCH2.30 | v61,58.5 61,57 SWITCH3.30 | v72.5,80 62,80 61,79 61,78.5 SWITCH6.30
  Bottom 0.152: v9,41.5 v9,55 9,60.5 8,61.5 v8,76 | 63.5,61 v71,53.5 | v72.5,80 72.5,74.57 72.56,74.5 72.56,70.06 63.5,61 | 63.5,61 61.78,59.28 61.29,59.28 60.96,59.62 60.96,59.9 60.66,60.19 60.24,60.19 59.95,59.9 59.95,59.48 60.24,59.19 60.31,59.19 v61,58.5
MOSI  (via drill 0.35)
  Top 0.152: PICO.GP3 13.97,6.35 v13.97,27.94 | v13.97,44.45 SWITCH1.3
  Bottom 0.152: v13.97,27.94 v13.97,44.45
N$2
  Top 0.152: SWITCH2.31 61.46,33.14 61.46,32.84 61.33,32.7 59.32,32.7 59.03,32.99 58.95,32.99 56.26,35.69 56.26,45.09 55.63,45.72 17-24.8
N$3
  Top 0.152: SWITCH2.32 62.73,33.14 62.73,32.84 62.58,32.69 61.74,32.69 61.45,32.4 59.2,32.4 58.91,32.69 58.62,32.69 55.93,35.38 55.93,43.05 55.02,43.97 47.85,43.97 46.1,45.72 17-24.7
N$4
  Top 0.152: SWITCH2.33 64,33.14 64,32.84 63.55,32.38 61.87,32.38 61.58,32.09 59.07,32.09 58.78,32.38 58.47,32.38 55.63,35.23 55.63,42.93 54.89,43.66 47.72,43.66 47.57,43.81 44.2,43.81 43.18,44.83 17-24.6
N$6
  Top 0.152: SWITCH2.34 65.27,33.14 65.27,32.84 64.22,31.79 58.95,31.79 58.86,31.88 58.55,31.88 55.24,35.18 55.24,42.8 54.69,43.36 42.24,43.36 40.64,44.96 17-24.5
N$7
  Top 0.152: SWITCH2.35 66.54,33.14 66.54,32.84 65.19,31.49 58.82,31.49 58.81,31.5 58.29,31.5 54.91,34.87 54.91,42.49 54.36,43.05 40.64,43.05 38.1,45.59 17-24.4
N$8
  Top 0.152: SWITCH2.36 67.81,33.14 67.81,32.84 66.14,31.17 58.12,31.17 54.61,34.67 54.61,42.04 53.92,42.72 36.52,42.72 35.56,43.69 17-24.3
N$9
  Top 0.152: SWITCH2.37 69.08,33.14 69.08,32.84 67.1,30.86 57.91,30.86 54.23,34.54 54.23,41.78 53.59,42.42 36.2,42.42 33.02,45.59 17-24.2
N$10
  Top 0.152: SWITCH2.38 70.35,33.14 70.35,32.84 67.99,30.48 57.66,30.48 53.85,34.29 53.85,41.27 53.09,42.04 35.05,42.04 34.92,42.16 34.04,42.16 17-24.1
N$11  (via drill 0.35)
  Top 0.152: SWITCH2.14 62.91,50.5 v62.91,51.23
  Bottom 0.152: v62.91,51.23 49.96,51.23 25-32.1
N$12  (via drill 0.35)
  Top 0.152: SWITCH2.13 64.12,50.56 v64.12,51.29
  Bottom 0.152: v64.12,51.29 63.71,51.29 63.16,51.83 62.66,51.83 62.64,51.82 48.01,51.82 25-32.2
N$13  (via drill 0.35)
  Top 0.152: SWITCH2.12 65.45,50.5 v65.45,51.23
  Bottom 0.152: v65.45,51.23 65.04,51.23 64.37,51.9 63.53,51.9 63.29,52.14 62.53,52.14 62.52,52.12 45.77,52.12 25-32.3
N$14  (via drill 0.35)
  Top 0.152: SWITCH2.11 66.72,50.5 v66.72,51.23
  Bottom 0.152: 25-32.4 43.54,52.43 62.39,52.43 62.41,52.44 65.5,52.44 v66.72,51.23
N$15  (via drill 0.35)
  Top 0.152: SWITCH2.10 67.93,50.56 v67.93,51.29
  Bottom 0.152: v67.93,51.29 67.52,51.29 66.97,51.83 66.91,51.83 66.37,52.38 66.04,52.38 65.67,52.75 62.28,52.75 62.26,52.73 41.3,52.73 25-32.5
N$16  (via drill 0.35)
  Top 0.152: SWITCH2.9 69.26,50.5 v69.26,51.23
  Bottom 0.152: v69.26,51.23 68.85,51.23 68.18,51.9 67.36,51.9 66.57,52.68 66.17,52.68 65.8,53.05 62.16,53.05 62.14,53.03 39.06,53.03 25-32.6
N$17  (via drill 0.35)
  Top 0.152: SWITCH2.8 70.53,50.5 v70.53,51.23
  Bottom 0.152: v70.53,51.23 69.56,52.2 67.56,52.2 66.78,52.98 66.3,52.98 65.92,53.36 62.03,53.36 62.01,53.34 36.83,53.34 25-32.7
N$18
  Top 0.152: 1-8.8 48.26,33.53 45.3,30.57 12.79,30.57 10.16,33.2 SWITCH1.31
N$19
  Top 0.152: 1-8.7 45.72,33.53 43.07,30.88 13.76,30.88 11.43,33.2 SWITCH1.32
N$20
  Top 0.152: 1-8.6 43.18,33.53 40.83,31.18 14.72,31.18 12.7,33.2 SWITCH1.33
N$21
  Top 0.152: 1-8.5 40.64,33.53 38.6,31.49 15.69,31.49 13.97,33.2 SWITCH1.34
N$22
  Top 0.152: 1-8.4 38.1,33.53 36.36,31.79 16.66,31.79 15.24,33.2 SWITCH1.35
N$23
  Top 0.152: 1-8.3 35.56,33.53 34.13,32.09 17.62,32.09 16.51,33.2 SWITCH1.36
N$24
  Top 0.152: 1-8.2 33.02,33.53 31.89,32.4 18.59,32.4 17.78,33.2 SWITCH1.37
N$25
  Top 0.152: 1-8.1 30.48,33.53 29.66,32.7 19.55,32.7 19.05,33.2 SWITCH1.38
N$26  (via drill 0.35)
  Top 0.152: SWITCH1.14 12.2,50.68 12.2,50.98 12.33,51.12 12.53,51.12 v12.83,51.42
  Bottom 0.152: v12.83,51.42 14.75,53.34 19.83,53.34 20.07,53.57 21.83,53.57 22.06,53.34 22.49,53.34 24.03,51.81 24.03,51.79 26.92,48.9 26.92,41.53 29.16,41.53 29.31,41.68 31.65,41.68 31.9,41.43 36.5,41.43 37.16,40.77 38.89,40.77 39.59,40.07 39.98,40.46 41.3,40.46 42.13,39.64 42.64,40.16 43.72,40.16 44.48,39.4 44.86,39.4 45.31,39.85 46.13,39.85 47.88,38.1 9-16.1
N$27  (via drill 0.35)
  Top 0.152: SWITCH1.13 13.47,50.68 13.47,50.98 13.6,51.12 13.67,51.12 v13.97,51.42
  Bottom 0.152: v13.97,51.42 15.59,53.03 19.96,53.03 20.19,53.27 21.7,53.27 21.94,53.03 22.37,53.03 23.72,51.68 23.72,51.67 26.62,48.77 26.62,41.4 26.8,41.22 29.29,41.22 29.44,41.38 31.52,41.38 31.78,41.12 36.37,41.12 37.03,40.46 38.76,40.46 39.59,39.64 40.1,40.16 41.18,40.16 42,39.34 42.25,39.34 42.77,39.85 43.59,39.85 44.17,39.27 44.17,37.8 44.67,37.8 44.98,38.1 9-16.2
N$28  (via drill 0.35)
  Top 0.152: SWITCH1.12 14.74,50.68 14.74,50.98 14.87,51.12 14.94,51.12 v15.24,51.42
  Bottom 0.152: v15.24,51.42 16.53,52.7 20.06,52.7 20.32,52.96 21.58,52.96 21.84,52.7 22.27,52.7 23.42,51.56 23.42,51.51 26.31,48.62 26.31,41.12 26.62,40.82 29.31,40.82 29.57,41.07 31.39,41.07 31.65,40.82 36.24,40.82 37.23,39.83 37.56,40.16 38.64,40.16 39.59,39.21 40.23,39.85 41.05,39.85 41.63,39.27 41.63,37.8 42.13,37.8 42.44,38.1 9-16.3
N$29  (via drill 0.35)
  Top 0.152: SWITCH1.11 16.01,50.68 16.01,50.98 16.14,51.12 16.19,51.12 v16.51,51.44
  Bottom 0.152: v16.51,51.44 17.48,52.4 20.18,52.4 20.44,52.66 21.45,52.66 21.71,52.4 22.14,52.4 23.11,51.43 23.11,51.39 26.01,48.49 26.01,41 26.49,40.51 29.44,40.51 29.69,40.77 31.27,40.77 31.52,40.51 36.12,40.51 37.23,39.4 37.69,39.85 38.51,39.85 39.09,39.27 39.09,38.35 39.78,38.35 40.08,38.66 9-16.4
N$30  (via drill 0.35)
  Top 0.152: SWITCH1.10 17.28,50.68 17.28,50.98 17.41,51.12 17.48,51.12 v17.78,51.42
  Bottom 0.152: 9-16.5 35.99,40.21 31.4,40.21 31.14,40.46 29.82,40.46 29.56,40.21 26.37,40.21 25.7,40.87 25.7,48.34 22.81,51.23 22.81,51.3 22.09,52.02 21.66,52.02 21.32,52.35 20.57,52.35 20.31,52.09 18.46,52.09 v17.78,51.42
N$31  (via drill 0.35)
  Top 0.152: SWITCH1.9 18.55,50.68 18.55,50.98 18.68,51.12 18.75,51.12 v19.05,51.42
  Bottom 0.152: v19.05,51.42 20.06,51.42 20.7,52.05 21.2,52.05 21.54,51.71 21.97,51.71 22.5,51.18 22.5,51.11 25.4,48.21 25.4,40.64 26.14,39.9 29.69,39.9 29.94,40.16 31.02,40.16 31.27,39.9 33.76,39.9 9-16.6
N$32  (via drill 0.35)
  Top 0.152: SWITCH1.8 19.82,50.68 19.82,50.98 20.28,51.44 v20.95,51.44
  Bottom 0.152: v20.95,51.44 20.98,51.41 21.84,51.41 22.2,51.05 22.2,50.19 25.09,47.3 25.09,40.51 25.4,40.21 25.4,39.37 29.59,39.37 30.07,39.85 30.89,39.85 32.64,38.1 9-16.7
N$33  (via drill 0.35)
  Top 0.152: SWITCH1.7 21.21,50.8 v21.59,50.8
  Bottom 0.152: 9-16.8 25.4,38.1 24.13,39.37 24.13,47.83 21.71,50.24 21.71,50.68 v21.59,50.8
N$34  (via drill 0.35)
  Top 0.152: SWITCH2.7 71.74,50.56 v71.74,51.29
  Bottom 0.152: 25-32.8 34.67,53.72 36.58,53.72 36.63,53.66 66.05,53.66 66.42,53.29 69.74,53.29 v71.74,51.29
N$36
  Top 0.152: 33-40.8 48.26,56.39 49.08,55.56 61.73,55.56 62.23,56.06 SWITCH3.31
N$37
  Top 0.152: 33-40.7 45.72,56.39 46.85,55.26 62.7,55.26 63.5,56.06 SWITCH3.32
N$38
  Top 0.152: 33-40.6 43.18,56.39 44.61,54.95 63.66,54.95 64.77,56.06 SWITCH3.33
N$39
  Top 0.152: 33-40.5 40.64,56.39 42.38,54.65 64.62,54.65 66.04,56.06 SWITCH3.34
N$40
  Top 0.152: 33-40.4 38.1,56.39 40.14,54.35 65.59,54.35 67.31,56.06 SWITCH3.35
N$41
  Top 0.152: 33-40.3 35.56,56.39 37.91,54.04 66.56,54.04 68.58,56.06 SWITCH3.36
N$42
  Top 0.152: 33-40.2 33.02,56.39 35.67,53.74 67.52,53.74 69.85,56.06 SWITCH3.37
N$43
  Top 0.152: 33-40.1 30.48,56.39 33.44,53.43 68.49,53.43 71.12,56.06 SWITCH3.38
N$44  (via drill 0.35)
  Top 0.152: SWITCH3.14 62.91,73.36 v62.91,74.09
  Bottom 0.152: v62.91,74.09 49.78,60.96 41-48.1
N$45  (via drill 0.35)
  Top 0.152: SWITCH3.13 64.18,73.36 v64.18,74.09
  Bottom 0.152: v64.18,74.09 63.57,74.69 62.66,74.69 50.7,62.74 47.5,62.74 41-48.2
N$46  (via drill 0.35)
  Top 0.152: SWITCH3.12 65.39,73.42 v65.39,74.15
  Bottom 0.152: v65.39,74.15 64.98,74.15 64.43,74.69 64.24,74.69 63.94,75 62.3,75 50.42,63.12 45.34,63.12 41-48.3
N$47  (via drill 0.35)
  Top 0.152: SWITCH3.11 66.66,73.42 v66.66,74.15
  Bottom 0.152: v66.66,74.15 65.5,75.31 61.98,75.31 54.61,67.94 54.61,67.82 50.24,63.45 43.13,63.45 41-48.4
N$48  (via drill 0.35)
  Top 0.152: SWITCH3.10 67.93,73.42 v67.93,74.15
  Bottom 0.152: 41-48.5 38.1,61.59 40.26,63.75 49.83,63.75 61.72,75.64 66.42,75.64 67.61,74.45 67.63,74.45 v67.93,74.15
N$49  (via drill 0.35)
  Top 0.152: SWITCH3.9 69.34,73.28 v69.34,74.17
  Bottom 0.152: v69.34,74.17 68.77,74.17 68.18,74.76 67.74,74.76 66.55,75.95 61.59,75.95 49.73,64.08 38.68,64.08 41-48.6
N$50  (via drill 0.35)
  Top 0.152: SWITCH3.8 70.47,73.42 v70.47,74.15
  Bottom 0.152: v70.47,74.15 70.22,74.15 69.59,74.78 69.09,74.78 69.08,74.76 68.61,74.76 68.31,75.06 67.94,75.06 66.73,76.28 61.42,76.28 49.53,64.39 36.45,64.39 41-48.7
N$51  (via drill 0.35)
  Top 0.152: SWITCH3.7 71.75,73.4 v71.75,74.17
  Bottom 0.152: v71.75,74.17 71.31,74.17 70.72,74.76 70.04,74.76 69.72,75.08 68.96,75.08 68.95,75.07 68.73,75.07 68.43,75.37 68.14,75.37 66.93,76.58 61.21,76.58 49.4,64.77 35.81,64.77 35.69,64.9 34.42,64.9 41-48.8
N$53
  Top 0.152: SWITCH4.31 10.93,56 10.93,55.7 13.29,53.34 23.5,53.34 26.54,56.39 26.54,63.37 27.43,64.26 44.45,64.26 48.26,68.07 49-56.8
N$54
  Top 0.152: SWITCH4.32 12.2,56 12.2,55.7 14.18,53.72 22.99,53.72 26.24,56.97 26.24,63.5 27.38,64.64 41.78,64.64 49-56.7
N$55
  Top 0.152: SWITCH4.33 13.47,56 13.47,55.7 15.14,54.03 22.4,54.03 25.91,57.53 25.91,64.01 27.05,65.15 39.75,65.15 49-56.6
N$56
  Top 0.152: SWITCH4.34 14.74,56 14.74,55.7 16.11,54.33 21.69,54.33 25.27,57.91 25.27,65.02 25.78,65.53 37.59,65.53 49-56.5
N$57
  Top 0.152: SWITCH4.35 16.01,56 16.01,55.7 17.07,54.63 21.23,54.63 24.89,58.29 24.89,65.66 25.27,66.04 35.56,66.04 49-56.4
N$58
  Top 0.152: SWITCH4.36 17.28,56 17.28,55.7 18.02,54.95 20.94,54.95 24.51,58.53 24.51,65.71 25.32,66.52 31.02,66.52 31.17,66.67 34.42,66.67 35.56,67.82 49-56.3
N$59
  Top 0.152: SWITCH4.37 18.55,56 18.55,55.7 18.68,55.56 19.52,55.56 19.83,55.26 20.81,55.26 24.21,58.65 24.21,65.86 25.17,66.83 30.89,66.83 31.04,66.98 31.55,66.98 33.02,68.45 49-56.2
N$60
  Top 0.152: 49-56.1 24.26,68.58 23.75,68.07 23.75,58.63 20.69,55.56 19.95,55.56 19.82,55.7 19.82,56 SWITCH4.38
N$61  (via drill 0.35)
  Top 0.152: SWITCH4.14 11.43,73.35 v12.09,74.01
  Bottom 0.152: v12.09,74.01 13.94,75.86 22.05,75.86 22.25,75.67 29.01,75.67 29.31,75.97 31.65,75.97 31.8,75.82 44.83,75.82 57-64.1
N$62  (via drill 0.35)
  Top 0.152: SWITCH4.13 13.3,73.37 v13.3,73.95
  Bottom 0.152: v13.3,73.95 13.8,74.45 15.2,74.45 15.57,74.82 15.85,74.82 16.26,75.23 18.63,75.23 18.96,75.56 21.92,75.56 22.12,75.36 29.13,75.36 29.44,75.67 31.52,75.67 31.83,75.36 38.53,75.36 39.45,74.45 41.18,74.45 41.33,74.3 43.94,74.3 45.72,72.52 57-64.2
N$63  (via drill 0.35)
  Top 0.152: SWITCH4.12 13.97,73.35 v14.57,73.95
  Bottom 0.152: 57-64.3 41.58,73.99 41.2,73.99 41.05,74.14 39.32,74.14 38.4,75.06 31.7,75.06 31.39,75.36 29.57,75.36 29.26,75.06 21.99,75.06 21.8,75.26 19.08,75.26 18.76,74.93 16.39,74.93 15.97,74.52 15.69,74.52 15.16,73.99 14.61,73.99 v14.57,73.95
N$64  (via drill 0.35)
  Top 0.152: SWITCH4.11 15.24,73.35 v15.9,74.01
  Bottom 0.152: v15.9,74.01 16.51,74.62 18.89,74.62 19.21,74.95 21.67,74.95 21.87,74.75 29.39,74.75 29.69,75.06 31.27,75.06 31.57,74.75 33.68,74.75 33.81,74.62 38.41,74.62 57-64.4
N$65  (via drill 0.35)
  Top 0.152: SWITCH4.10 16.51,73.35 v17.17,74.01
  Bottom 0.152: v17.17,74.01 17.87,74.01 18.14,74.29 18.98,74.29 19.34,74.65 21.54,74.65 21.74,74.45 29.51,74.45 29.82,74.75 31.14,74.75 31.45,74.45 33.56,74.45 33.86,74.14 36.35,74.14 57-64.5
N$66  (via drill 0.35)
  Top 0.152: SWITCH4.9 17.78,73.22 v18.35,73.79
  Bottom 0.152: 57-64.6 34.24,73.71 33.86,73.71 33.43,74.14 31.32,74.14 31.02,74.45 29.94,74.45 29.64,74.14 21.62,74.14 21.42,74.34 20.75,74.34 20.42,74.02 20.11,74.02 19.83,74.29 19.41,74.29 18.91,73.79 v18.35,73.79
N$67  (via drill 0.35)
  Top 0.152: SWITCH4.8 19.62,73.34 v19.62,73.79
  Bottom 0.152: 57-64.7 31.93,73.48 31.55,73.48 30.89,74.14 30.07,74.14 29.77,73.84 21.49,73.84 21.29,74.04 20.87,74.04 20.32,73.48 20,73.48 19.69,73.79 v19.62,73.79
N$68  (via drill 0.35)
  Top 0.152: SWITCH4.7 v21.08,73.53
  Bottom 0.152: v21.08,73.53 29.34,73.53 57-64.8
N$70
  Top 0.152: 65-72.8 48.26,79.25 45.3,76.29 12.79,76.29 10.16,78.92 SWITCH5.31
N$71
  Top 0.152: 65-72.7 45.72,79.25 43.07,76.6 13.76,76.6 11.43,78.92 SWITCH5.32
N$72
  Top 0.152: 65-72.6 43.18,79.25 40.83,76.9 14.72,76.9 12.7,78.92 SWITCH5.33
N$73
  Top 0.152: 65-72.5 40.64,79.25 38.6,77.21 15.69,77.21 13.97,78.92 SWITCH5.34
N$74
  Top 0.152: 65-72.4 38.1,79.25 36.36,77.51 16.66,77.51 15.24,78.92 SWITCH5.35
N$75
  Top 0.152: 65-72.3 35.56,79.25 34.13,77.81 17.62,77.81 16.51,78.92 SWITCH5.36
N$76
  Top 0.152: 65-72.2 33.02,79.25 31.89,78.12 18.59,78.12 17.78,78.92 SWITCH5.37
N$77
  Top 0.152: 65-72.1 30.48,79.25 29.66,78.42 19.55,78.42 19.05,78.92 SWITCH5.38
N$78  (via drill 0.35)
  Top 0.152: v12.66,97.03 12.46,96.83 12.33,96.83 11.43,95.93 SWITCH5.14
  Bottom 0.152: v12.66,97.03 13.29,97.66 15.12,97.66 15.38,97.92 15.63,97.92 16.61,98.9 20.55,98.9 20.65,98.81 22.86,98.81 26.29,95.38 26.29,87.38 29.29,87.38 29.31,87.4 31.65,87.4 31.67,87.38 44.7,87.38 73-80.1
N$79  (via drill 0.35)
  Top 0.152: SWITCH5.13 12.7,96.21 v13.36,96.87
  Bottom 0.152: v13.36,96.87 13.92,96.87 14.36,97.31 15.2,97.31 15.5,97.62 15.75,97.62 16.73,98.6 20.43,98.6 20.52,98.5 22.66,98.5 25.98,95.17 25.98,87.25 26.16,87.07 29.41,87.07 29.44,87.1 31.52,87.1 31.55,87.07 42.47,87.07 73-80.2
N$80  (via drill 0.35)
  Top 0.152: SWITCH5.12 14.57,96.23 v14.57,96.81
  Bottom 0.152: v14.57,96.81 15.13,96.81 15.63,97.31 16.03,97.31 17.01,98.29 20.3,98.29 20.39,98.2 22.2,98.2 25.68,94.72 25.68,87.12 26.04,86.77 29.54,86.77 29.57,86.79 31.39,86.79 31.42,86.77 40.23,86.77 73-80.3
N$81  (via drill 0.35)
  Top 0.152: SWITCH5.11 15.24,96.21 v15.84,96.81
  Bottom 0.152: v15.84,96.81 16.04,97.01 16.16,97.01 17.14,97.99 20.17,97.99 20.27,97.89 21.74,97.89 25.38,94.26 25.38,87 25.91,86.46 29.67,86.46 29.69,86.49 31.27,86.49 31.29,86.46 38,86.46 73-80.4
N$82  (via drill 0.35)
  Top 0.152: SWITCH5.10 16.51,96.21 v17.17,96.87
  Bottom 0.152: v17.17,96.87 17.73,96.87 18.17,97.31 19.01,97.31 19.38,97.68 20.05,97.68 20.14,97.59 21.54,97.59 25.07,94.06 25.07,86.87 25.78,86.16 29.79,86.16 29.82,86.18 31.14,86.18 31.17,86.16 35.76,86.16 73-80.5
N$83  (via drill 0.35)
  Top 0.152: SWITCH5.9 17.78,96.21 v18.38,96.81
  Bottom 0.152: 73-80.6 33.66,85.72 31.17,85.72 31.02,85.88 29.94,85.88 29.92,85.85 25.66,85.85 24.77,86.75 24.77,93.6 21.89,96.47 21.89,96.73 21.34,97.28 20.02,97.28 19.92,97.38 19.5,97.38 18.94,96.81 v18.38,96.81
N$84  (via drill 0.35)
  Top 0.152: SWITCH5.8 19.05,96.21 v19.71,96.87
  Bottom 0.152: v19.71,96.87 20.85,96.87 20.87,96.9 21.29,96.9 21.59,96.6 21.59,96.35 24.46,93.47 24.46,86.62 25.53,85.55 30.04,85.55 30.07,85.57 30.89,85.57 32.64,83.82 73-80.7
N$85  (via drill 0.35)
  Top 0.152: SWITCH5.7 v21.08,96.39
  Bottom 0.152: v21.08,96.39 24,93.47 24,85.6 25.78,83.82 73-80.8
N$86
  Top 0.152: PICO.GP0 6.57,3.59 6.57,2.99 9.18,0.38 64.77,0.38 JP14.2
N$87
  Top 0.152: 81-88.8 55.75,91.44 56.52,90.68 56.52,79.76 59.08,77.19 59.29,77.19 59.32,77.16 61.33,77.16 61.46,77.29 61.46,78.34 61.79,78.67 62.09,78.36 SWITCH6.31
N$88
  Top 0.152: SWITCH6.32 62.73,77.59 62.73,77.29 62.6,77.16 61.76,77.16 61.45,76.85 59.2,76.85 59.16,76.89 58.88,76.89 56.06,79.7 56.06,89.36 55.73,89.69 47.85,89.69 46.1,91.44 81-88.7
N$89
  Top 0.152: SWITCH6.33 64,77.59 64,77.29 63.26,76.55 59.07,76.55 59.03,76.58 58.67,76.58 55.75,79.5 55.75,88.9 55.27,89.38 47.72,89.38 47.7,89.41 44.32,89.41 43.18,90.55 81-88.6
N$90
  Top 0.152: SWITCH6.34 65.27,77.59 65.27,77.29 64.22,76.24 58.95,76.24 58.94,76.25 58.5,76.25 55.37,79.38 55.37,88.27 54.61,89.03 42.04,89.03 40.64,90.42 81-88.5
N$91
  Top 0.152: SWITCH6.35 66.54,77.59 66.54,77.29 65.19,75.94 58.82,75.94 58.81,75.95 58.17,75.95 54.86,79.25 54.86,86.94 54.91,87 54.91,87.83 54.1,88.65 40.89,88.65 81-88.4
N$92
  Top 0.152: SWITCH6.36 67.81,77.59 67.81,77.29 66.14,75.62 57.99,75.62 54.48,79.12 54.48,87 54.61,87.12 54.61,87.5 53.85,88.27 38.73,88.27 81-88.3
N$93
  Top 0.152: SWITCH6.37 69.08,77.59 69.08,77.29 67.1,75.31 57.78,75.31 54.1,78.99 54.1,87.12 53.34,87.88 36.58,87.88 81-88.2
N$94
  Top 0.152: SWITCH6.38 70.35,77.59 70.35,77.29 67.99,74.93 57.66,74.93 53.72,78.87 53.72,86.74 52.96,87.5 34.42,87.5 81-88.1
N$95
  Top 0.152: 89-96.1 48.26,96.01 62.55,96.01 63.5,95.06 SWITCH6.14
N$96
  Top 0.152: SWITCH6.13 64,95.13 64,95.43 62.91,96.52 49.15,96.52 48.67,97 47.85,97 47.37,96.52 46.99,96.52 89-96.2
N$97
  Top 0.152: 89-96.3 43.18,96.01 44.17,97 47.42,97 47.72,97.31 48.8,97.31 49.1,97 64.1,97 66.04,95.06 SWITCH6.12
N$98
  Top 0.152: 89-96.4 40.64,96.01 41.94,97.31 47.29,97.31 47.6,97.61 48.92,97.61 49.23,97.31 65.07,97.31 67.31,95.06 SWITCH6.11
N$99
  Top 0.152: 89-96.5 38.1,96.01 39.7,97.61 47.17,97.61 47.47,97.92 49.05,97.92 49.35,97.61 66.03,97.61 68.58,95.06 SWITCH6.10
N$100
  Top 0.152: 89-96.6 35.56,96.01 37.47,97.92 47.04,97.92 47.34,98.22 49.17,98.22 49.48,97.92 67,97.92 69.85,95.06 SWITCH6.9
N$101
  Top 0.152: 89-96.7 33.02,96.01 35.23,98.22 46.91,98.22 47.22,98.53 49.3,98.53 49.61,98.22 67.96,98.22 71.12,95.06 SWITCH6.8
N$102
  Top 0.152: 89-96.8 30.48,96.01 32.99,98.53 46.79,98.53 47.09,98.83 49.43,98.83 49.73,98.53 68.93,98.53 72.39,95.06 SWITCH6.7
N$103
  Top 0.152: PICO.GP1 9.11,3.59 9.11,2.99 10.83,1.27 62.23,1.27 63.02,2.06 63.02,4.22 64.77,5.97 JP14.1
N$104
  Top 0.152: JP15.2 55.21,3.81 53.78,2.38 19.88,2.38 19.27,2.99 19.27,3.59 PICO.GP4
N$105
  Top 0.152: PICO.GP5 21.37,5.08 22.42,6.13 59.47,6.13 JP15.1
PCLK  (via drill 0.3)
  Top 0.152: v72.5,42.5 73.5,42.5 74,42 SWITCH2.1 | v72.5,64.5 74,64.5 SWITCH3.1 | v72.5,86 73.5,86 74,86.5 SWITCH6.1 | v20.5,42.5 21,42.5 21.5,42 SWITCH1.1 22,42 22.5,42 23.5,41 49,41 v49.5,41.5 | v12,64 12.5,64.5 21.5,64.5 SWITCH4.1 | v10.5,87.5 21.5,87.5 SWITCH5.1
  Bottom 0.152: 73,64 73,43 v72.5,42.5 65.5,49.5 49.5,49.5 v49.5,41.5 | v72.5,64.5 73,64 | v72.5,86 73,85.5 73,64 | v20.5,42.5 12,51 v12,64 12,69 10.5,70.5 v10.5,87.5
SCLK  (via drill 0.3, 0.35)
  Top 0.152: PICO.GP2 12.7,21.37 11.65,22.42 11.65,25.4 11.43,25.4 v11.43,27.94 | v11.43,43.18 SWITCH1.2 | v72.5,43.5 73.5,43.5 74,43 SWITCH2.2 | v72,65.5 72.5,66 74,66 SWITCH3.2 74.5,66 75.5,66 v76.5,67 | v76,87.5 74.5,87.5 SWITCH6.2 74,87.5 73.5,88 63.5,88 v60,91.5 | v11.5,65 20.5,65 21.5,66 SWITCH4.2 | v10,88 20.5,88 21.5,89 SWITCH5.2 22,89 22.5,89 v29,95.5
  Bottom 0.152: v11.43,27.94 v11.43,43.18 11.5,43 v11.5,65 11.5,69 10,70.5 v10,88 | v72,65.5 72,64 72.57,63.43 72.57,45.98 72.5,45.91 v72.5,43.5 | v76,87.5 76.5,87 v76.5,67 | v60,91.5 54,97.5 29,97.5 v29,95.5
VCC  (via drill 0.3, 0.35)
  Top 0.152: v15.24,27.94 PICO.3V3 16.73,24.35 16.73,24.95 17.34,25.56 46.16,25.56 46.32,25.4 47.66,25.4 47.82,25.56 48.7,25.56 49.31,24.95 49.31,22.86 50.36,21.81 51.19,21.81 60.31,12.69 77,12.69 79,14.69 v79,18.5 | v15.24,38.1 SWITCH1.42 | v79,39.5 76,39.5 74.5,38 SWITCH2.42 | v79,56.82 79,60.99 79.01,61 74.5,61 SWITCH3.42 | v78,82.5 74.5,82.5 SWITCH6.42 | v10,60.5 21,60.5 21.5,61 SWITCH4.42 | v9,82.5 20,82.5 21.5,84 SWITCH5.42
  Bottom 0.152: v15.24,38.1 v15.24,27.94 15,28 15,27 11.5,27 10,28.5 v10,60.5 10,61.5 8.5,63 8.5,82 v9,82.5 | v78,82.5 79,81.5 v79,56.82 v79,39.5 v79,18.5
VDD  (via drill 0.3)
  Top 0.152: v78.5,39 76.5,37 74.5,37 SWITCH2.41 | v78.5,59.75 78.25,59.5 74.5,59.5 SWITCH3.41 | v78,78 74.5,81.5 SWITCH6.41 | v10.5,60 21,60 21.5,59.5 SWITCH4.41 | SWITCH1.41 21.5,37 21,37.5 v10.5,37.5 9.5,37.5 9.5,32.5 4,32.5 4,29 15,29 16.5,27.5 52,27.5 52,22.5 61.31,13.19 73.66,13.19 | v9,81.5 20.5,81.5 21.5,82.5 SWITCH5.41 | v78.5,19 78.5,15.19 76.5,13.19 73.66,13.19 | VDD/VSS.1 73.66,13.19
  Bottom 0.152: v78,78 78.5,77.5 v78.5,59.75 v78.5,39 v78.5,19 | v10.5,37.5 v10.5,60 10.5,62 9,63.5 v9,81.5
VSS  (via drill 0.3, 0.35)
  Top 0.152: v77.5,48.5 74.5,45.5 SWITCH2.4 73.27,44.95 72.97,44.95 71.88,43.87 71.88,42.06 71.52,41.7 71.52,41.3 71.88,40.94 v71.88,40.01 | v77.5,68 77,68.5 74.5,68.5 SWITCH3.4 | v77.5,89.5 75,89.5 74.5,90 SWITCH6.4 74,90 73.5,90.5 v62,90.5 | v11,47 20,47 21.5,45.5 SWITCH1.4 | v11,68.5 21.5,68.5 SWITCH4.4 | v11,91.5 21.5,91.5 SWITCH5.4 22,91.5 22.5,91.5 v29,98 | v72.01,36.32 75.82,36.32 v75.95,36.2
  Bottom 0.152: v77.5,48.5 v77.5,68 77.5,83.33 77.35,83.48 77.35,83.9 77.5,84.05 v77.5,89.5 | v11,47 v11,68.5 9.5,70 9.5,90 v11,91.5 | v62,90.5 54.5,98 v29,98 | v71.88,40.01 71.88,38.81 72.13,38.56 72.13,38.15 72.01,38.02 v72.01,36.32 | v75.95,36.2 75.95,24.77 75.21,24.03 75.21,16.23 VDD/VSS.2